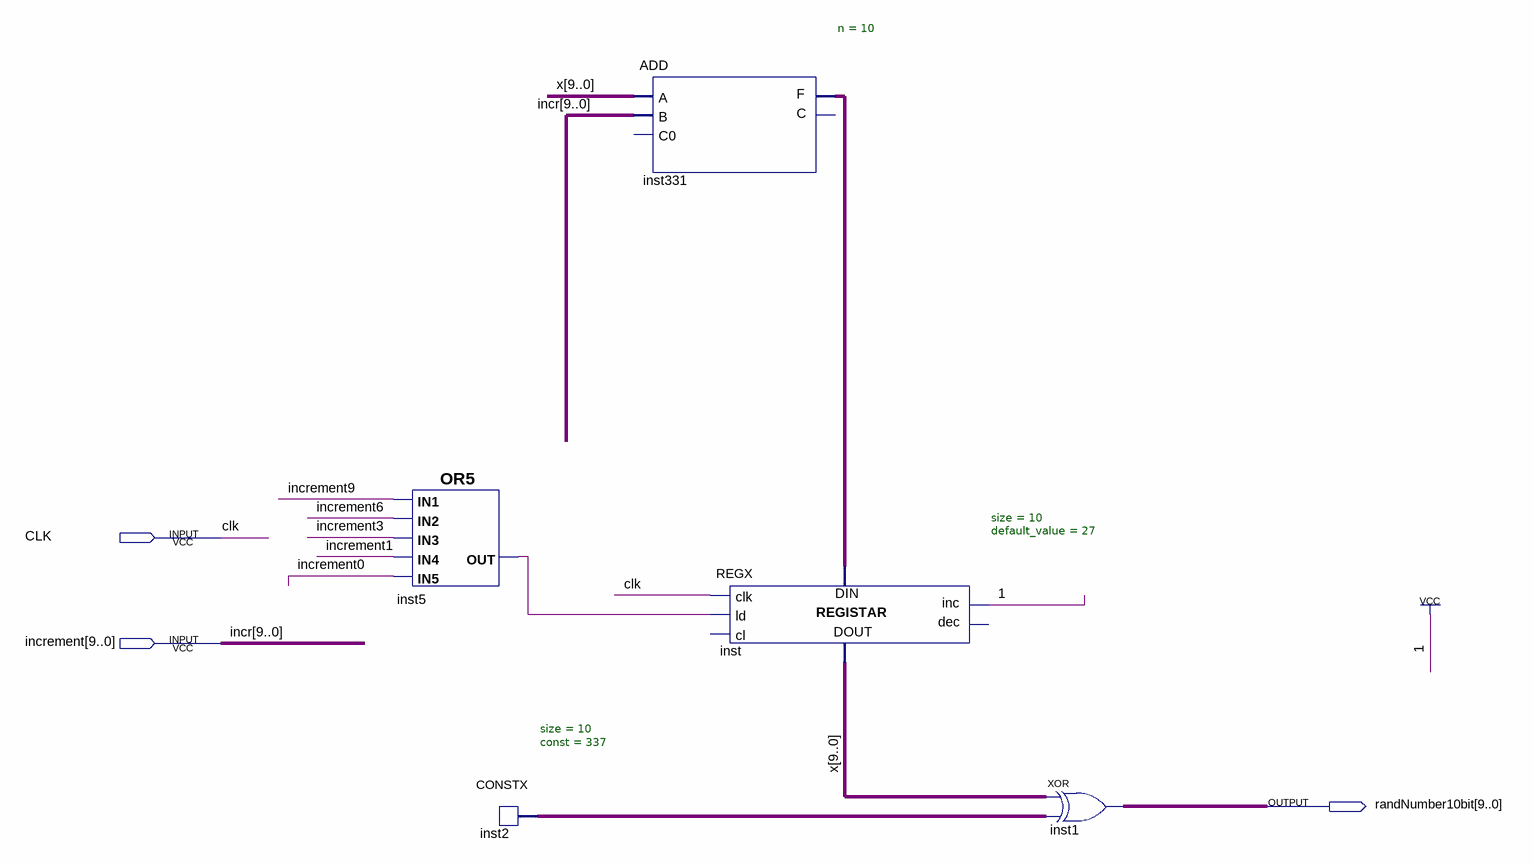
[diagram p0: schematic sheet]
// Quartus schematic RandomGenerator.bdf as structural Verilog: 5 symbols, 3 pins
module RandomGenerator (
  input  CLK,
  input  [9:0] increment,
  output [9:0] randNumber10bit
);

  wire inst5_out;
  wire [9:0] inst2_data, inst331_f, x;

  or inst5 (inst5_out, increment[9], increment[6], increment[3], increment[1], increment[0]);
  CONSTX #(.size(10), .\const (337)) inst2 (.data(inst2_data));
  ADD #(.n(10)) inst331 (.A(x), .B(increment), .F(inst331_f));  // open: C0, C
  REGX #(.size(10), .default_value(27)) inst (
    .clk(CLK), .ld(inst5_out), .inc(1'b1), .data_in(inst331_f), .data_out(x));  // open: cl, dec
  assign randNumber10bit = x ^ inst2_data;  // XOR inst1, 10 bits wide

  // Other names for the same wires on the sheet: incr[9:0] = increment
endmodule
